# Altium schematic sheet Controller Board - Connectors.SchDoc: Controller Board - Connectors
size B; Organization: Midnight Sun Solar Rayce Car Team; Address1: University of Waterloo; Address2: 200 University Ave W; Address3: Waterloo, ON, Canada; Address4: N2L 3E9; DocumentNumber: 1; SheetNumber: 1; SheetTotal: 3; Website: www.uwmidsun.com; ProjectName: ProjectName
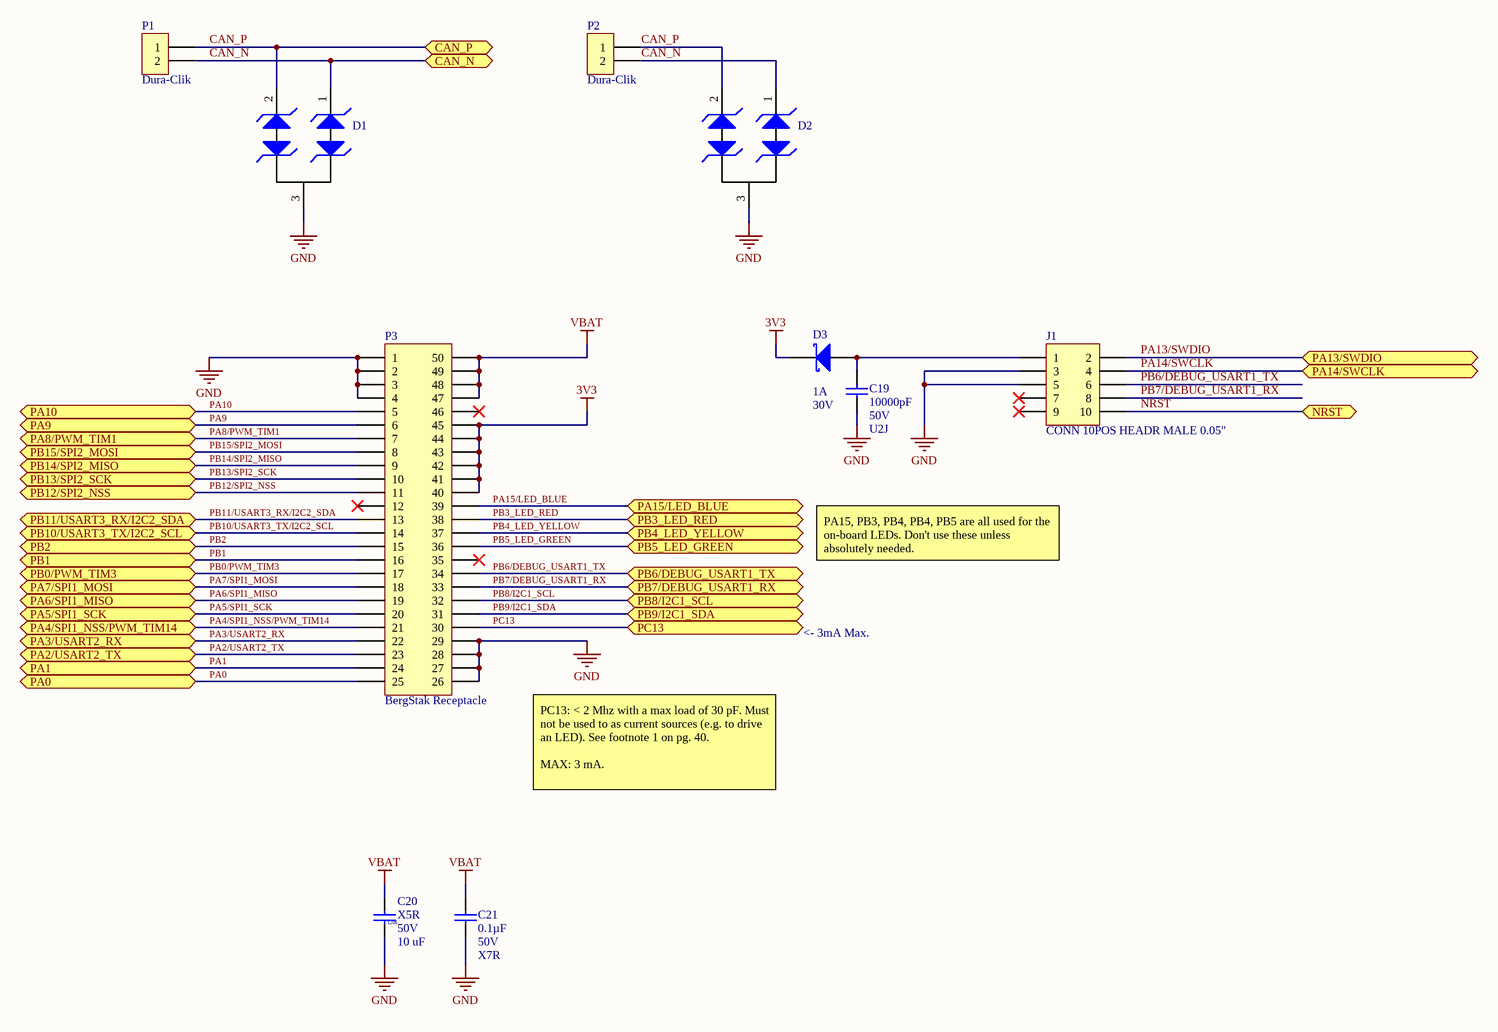
[diagram p0: Controller Board - Connectors.SchDoc]

## Parts
C19  Capacitance: 10000pF  Voltage: 50V  Temperature Coefficient: U2J  [CAP, 0603]  (hidden comment: CAP CER 10nF 50V 5% X7R 0603)
C20  Rating: X5R  Voltage Rating: 50V  Capacitance: 10 uF  [CAP, 1206]  (hidden comment: CAP CER 10uF 50V 20% X5R 1206)
C21  Capacitance: 0.1µF  Voltage: 50V  Temperature Coefficient: X7R  [CAP, 0603]  (hidden comment: CAP CER 0.1UF 50V 10% X7R 0603)
D1  DIODE TVS 24VWM 70VC SOT23  [MOSFET P-CH 30V 3.8A SOT-23]  (value not drawn)
D2  DIODE TVS 24VWM 70VC SOT23  [MOSFET P-CH 30V 3.8A SOT-23]  (value not drawn)
D3  Current - Average Rectified (Io): 1A  Voltage - DC Reverse (Vr) (Max): 30V  [DIODE SCHOTTKY 30V 1A POWERDI123]  (hidden comment: DIODE SCHOTTKY 30V 1A POWERDI123)
J1  CONN 10POS HEADR MALE 0.05"  [CONN, 10POS 0.05" Debug Header]
P1  Dura-Clik  [CONN, 2POS Dura-Click Vertical]
P2  Dura-Clik  [CONN, 2POS Dura-Click Vertical]
P3  Series: BergStak Receptacle  [CONN, Bergstak 50 Pos Receptacle]  (hidden comment: CONN 50POS Bergstak Receptacle 0.02")

## Ports
CAN_N (bidir), CAN_P (bidir), NRST (bidir), PA0 (bidir), PA1 (bidir), PA2/USART2_TX (bidir), PA3/USART2_RX (bidir), PA4/SPI1_NSS/PWM_TIM14 (bidir), PA5/SPI1_SCK (bidir), PA6/SPI1_MISO (bidir), PA7/SPI1_MOSI (bidir), PA8/PWM_TIM1 (bidir), PA9 (bidir), PA10 (bidir), PA13/SWDIO (bidir), PA14/SWCLK (bidir), PA15/LED_BLUE (bidir), PB0/PWM_TIM3 (bidir), PB1 (bidir), PB2 (bidir), PB3_LED_RED (bidir), PB4_LED_YELLOW (bidir), PB5_LED_GREEN (bidir), PB6/DEBUG_USART1_TX (bidir), PB7/DEBUG_USART1_RX (bidir), PB8/I2C1_SCL (bidir), PB9/I2C1_SDA (bidir), PB10/USART3_TX/I2C2_SCL (bidir), PB11/USART3_RX/I2C2_SDA (bidir), PB12/SPI2_NSS (bidir), PB13/SPI2_SCK (bidir), PB14/SPI2_MISO (bidir), PB15/SPI2_MOSI (bidir), PC13 (bidir)

## Nets
3V3: D3.2(K) P3.40 P3.41 P3.42 P3.43 P3.44 P3.45
GND: C19.2 C20.2 C21.2 D1.3(Common_Cathode) D2.3(Common_Cathode) J1.3 J1.5 P3.1 P3.2 P3.3 P3.4 P3.26 P3.27 P3.28 P3.29
VBAT: C20.1 C21.1 P3.47 P3.48 P3.49 P3.50
CAN_N: D1.1(Cathode1) D2.1(Cathode1) P1.2 P2.2 ; port CAN_N
CAN_P: D1.2(Cathode2) D2.2(Cathode2) P1.1 P2.1 ; port CAN_P
NRST: J1.10 ; port NRST
PA0: P3.25 ; port PA0
PA1: P3.24 ; port PA1
PA2/USART2_TX: P3.23 ; port PA2/USART2_TX
PA3/USART2_RX: P3.22 ; port PA3/USART2_RX
PA4/SPI1_NSS/PWM_TIM14: P3.21 ; port PA4/SPI1_NSS/PWM_TIM14
PA5/SPI1_SCK: P3.20 ; port PA5/SPI1_SCK
PA6/SPI1_MISO: P3.19 ; port PA6/SPI1_MISO
PA7/SPI1_MOSI: P3.18 ; port PA7/SPI1_MOSI
PA8/PWM_TIM1: P3.7 ; port PA8/PWM_TIM1
PA9: P3.6 ; port PA9
PA10: P3.5 ; port PA10
PA13/SWDIO: J1.2 ; port PA13/SWDIO
PA14/SWCLK: J1.4 ; port PA14/SWCLK
PA15/LED_BLUE: P3.39 ; port PA15/LED_BLUE
PB0/PWM_TIM3: P3.17 ; port PB0/PWM_TIM3
PB1: P3.16 ; port PB1
PB2: P3.15 ; port PB2
PB3_LED_RED: P3.38 ; port PB3_LED_RED
PB4_LED_YELLOW: P3.37 ; port PB4_LED_YELLOW
PB5_LED_GREEN: P3.36 ; port PB5_LED_GREEN
PB6/DEBUG_USART1_TX: J1.6 P3.34 ; port PB6/DEBUG_USART1_TX
PB7/DEBUG_USART1_RX: J1.8 P3.33 ; port PB7/DEBUG_USART1_RX
PB8/I2C1_SCL: P3.32 ; port PB8/I2C1_SCL
PB9/I2C1_SDA: P3.31 ; port PB9/I2C1_SDA
PB10/USART3_TX/I2C2_SCL: P3.14 ; port PB10/USART3_TX/I2C2_SCL
PB11/USART3_RX/I2C2_SDA: P3.13 ; port PB11/USART3_RX/I2C2_SDA
PB12/SPI2_NSS: P3.11 ; port PB12/SPI2_NSS
PB13/SPI2_SCK: P3.10 ; port PB13/SPI2_SCK
PB14/SPI2_MISO: P3.9 ; port PB14/SPI2_MISO
PB15/SPI2_MOSI: P3.8 ; port PB15/SPI2_MOSI
PC13: P3.30 ; port PC13
NetC19_1: C19.1 D3.1(A) J1.1

Not connected (* = marked no-connect by the designer): J1 7* 9*; P3 12* 35* 46*

## Notes on the sheet
- PA15, PB3, PB4, PB4, PB5 are all used for the on-board LEDs. Don't use these unless absolutely needed.
- <- 3mA Max.
- PC13: < 2 Mhz with a max load of 30 pF. Must not be used to as current sources (e.g. to drive an LED). See footnote 1 on pg. 40.
  MAX: 3 mA.
- PROJECT
- DOCUMENT
- DRAWN BY
- LAST MODIFIED
- PART NUMBER
- REVISION
- SHEET
- VARIANT
- OF
- Engineering 5 - 1002
  University of Waterloo
  (519) 888-4567 x32978
  hardware@uwmidsun.com

## Library data of the parts
C19 = CAP CER 10nF 50V 5% X7R 0603: 10000pF ±5% 50V Ceramic Capacitor U2J 0603 (1608 Metric); Manufacturer 1: KEMET; Manufacturer Part Number 1: C0603C103J5JAC7867; Supplier 1: Digi-Key; Supplier Part Number 1: 399-13384-1-ND; Packaging: Cut Tape (CT); Part Status: Active; Operating Temperature: -55°C ~ 125°C; Ratings: -; Mounting Type: Surface Mount, MLCC; Package / Case: 0603 (1608 Metric); Size / Dimension: 0.063" L x 0.032" W (1.60mm x 0.80mm); Height - Seated (Max): -; Thickness (Max): 0.034" (0.87mm); Lead Spacing: -; Lead Style: -; ComponentLink1URL: http://www.kemet.com/docfinder?Partnumber=C0603C103J5JAC7867; ComponentLink1Description: http://www.kemet.com/docfinder?Partnumber=C0603C103J5JAC7867; Tolerance: ±5%; Failure Rate: -
C20 = CAP CER 10uF 50V 20% X5R 1206: 10µF ±20% 50V Ceramic Capacitor X5R 1206 (3216 Metric) /; Manufacturer: Murata; Manufacturer Part Number: GRT31CR61H106ME01L; Supplier 1: Digi-Key; Supplier Part Number 1: 490-12457-1-ND; RoHS: Yes; Stock 1: 449467; Pricing 1: 1 = 0.57000, 10 = 0.39800, 100 = 0.23910, 500 = 0.17930, 1000 = 0.15141 (USD); Mount: Surface Mount; Case/Package: 1206; Case Code (Metric): 3216; Case Code (Imperial): 1206; Min Operating Temperature: -55°C; Max Operating Temperature: 85°C; Packaging: Tape and Reel; Tolerance: 20%; Length: 0.126inch; Width: 0.063inch; Thickness: 0.071inch; Ratings: AEC-Q200
C21 = CAP CER 0.1UF 50V 10% X7R 0603: 0.10µF ±10% 50V Ceramic Capacitor X7R 0603 (1608 Metric); Manufacturer 1: AVX Corporation; Manufacturer Part Number 1: 06035C104KAT2A; Supplier 1: Digi-Key; Supplier Part Number 1: 478-5052-1-ND; Packaging: Cut Tape (CT); Part Status: Active; Operating Temperature: -55°C ~ 125°C; Ratings: -; Mounting Type: Surface Mount, MLCC; Package / Case: 0603 (1608 Metric); Size / Dimension: 0.063" L x 0.032" W (1.60mm x 0.81mm); Height - Seated (Max): -; Thickness (Max): 0.035" (0.90mm); Lead Spacing: -; Lead Style: -; ComponentLink1URL: http://datasheets.avx.com/X7RDielectric.pdf; ComponentLink1Description: http://datasheets.avx.com/X7RDielectric.pdf; Tolerance: ±10%
D1 D2 = DIODE TVS 24VWM 70VC SOT23: TVS DIODE 24VWM 70VC SOT23; Manufacturer 1: Nexperia USA Inc.; Manufacturer Part Number 1: PESD1CAN,215; Type: Zener; Voltage - Breakdown (Min): 25.4V; Voltage - Clamping (Max) @ Ipp: 70V; Current - Peak Pulse (10/1000µs): 3A (8/20µs); Power - Peak Pulse: 200W; Power Line Protection: No; Capacitance @ Frequency: 11pF @ 1MHz; Supplier 1: Digi-Key; Supplier Part Number 1: 1727-3817-1-ND; Packaging: Cut Tape (CT); Part Status: Active; Operating Temperature: -65°C ~ 150°C (TA); Mounting Type: Surface Mount; Package / Case: TO-236-3, SC-59, SOT-23-3; Supplier Device Package: SOT-23 (TO-236AB); ComponentLink1URL: http://assets.nexperia.com/documents/data-sheet/PESD1CAN.pdf; ComponentLink1Description: http://assets.nexperia.com/documents/data-sheet/PESD1CAN.pdf
D3 = DIODE SCHOTTKY 30V 1A POWERDI123: Diode Schottky 30V 1A Surface Mount PowerDI™ 123; Manufacturer: Diodes Incorporated; Manufacturer Part Number: DFLS130L-7; Speed: Fast Recovery =< 500ns, > 200mA (Io); Current - Reverse Leakage @ Vr: 1mA @ 30V; Capacitance @ Vr, F: 76pF @ 10V, 1MHz; Voltage - Forward (Vf) (Max) @ If: 310mV @ 1A; Supplier 1: Digi-Key; RoHS: RoHS Compliant; Category: Discrete Semiconductor Products; Stock 1: 68200; Packaging: Cut Tape (CT); Part Status: Active; Diode Type: Schottky; Mounting Type: Surface Mount; Package / Case: POWERDI®123; Supplier Device Package: PowerDI™ 123; Operating Temperature - Junction: -40°C ~ 125°C; ComponentLink1URL: https://www.diodes.com/assets/Datasheets/ds30492.pdf; ComponentLink1Description: https://www.diodes.com/assets/Datasheets/ds30492.pdf; Supplier Part Number 1: DFLS130LDICT-ND; Pricing 1: 1=0.7, 10=0.599, 100=0.447, 500=0.35126, 1000=0.27142 (CAD)
J1 = CONN 10POS HEADR MALE 0.05": 10 Positions Header Connector 0.050" (1.27mm) Surface Mount Gold; Manufacturer 1: Amphenol FCI; Manufacturer Part Number 1: 20021121-00010C4LF; Style: Board to Board; Shrouding: Unshrouded; Number of Positions: 10; Number of Positions Loaded: All; Contact Length - Mating: 0.120" (3.05mm); Material Flammability Rating: UL94 V-0; Supplier 1: Digi-Key; Supplier Part Number 1: 609-3695-1-ND; Packaging: Cut Tape (CT); Part Status: Active; Connector Type: Header; Contact Type: Male Pin; Number of Rows: 2; Row Spacing - Mating: 0.050" (1.27mm); Mounting Type: Surface Mount; Termination: Solder; Fastening Type: -; Contact Length - Post: -; Overall Contact Length: -; Insulation Height: -; Contact Shape: Square; Contact Finish - Mating: Gold; Contact Finish Thickness - Mating: 10µin (0.25µm); Contact Finish - Post: Tin; Contact Material: Copper Alloy; Insulation Material: Thermoplastic; Operating Temperature: -; Ingress Protection: -; Insulation Color: Black; Current Rating: -; Mated Stacking Heights: -; Contact Finish Thickness - Post: 50µin (1.27µm); ComponentLink1URL: http://portal.fciconnect.com/Comergent//fci/drawing/20021121.pdf; ComponentLink1Description: http://portal.fciconnect.com/Comergent//fci/drawing/20021121.pdf; Voltage: -; Pitch - Mating: 0.050" (1.27mm)
P1 P2 = CONN 2POS DURA-CLIK 0.079" VERT: 2 Positions Header, Shrouded Connector 0.079" (2.00mm) Surface Mount, Vertical Tin; Manufacturer: Molex, LLC; Manufacturer Part Number: 5600200220; Style: Board to Cable/Wire; Shrouding: Shrouded - 4 Wall; Number of Positions: 2; Number of Positions Loaded: All; Mated Stacking Heights: 9.3mm; Supplier 1: Digi-Key; RoHS: RoHS Compliant; Category: Connectors, Interconnects; Stock 1: 11912; Pricing 1: 1=1.16, 10=1.012, 25=0.952, 50=0.9122, 100=0.8727, 250=0.79336 (CAD); Packaging: Cut Tape (CT); Part Status: Active; Connector Type: Header; Contact Type: Male Pin; Pitch - Mating: 0.079" (2.00mm); Number of Rows: 1; Row Spacing - Mating: -; Mounting Type: Surface Mount; Termination: Solder; Fastening Type: Latch Lock; Contact Length - Mating: -; Contact Length - Post: -; Overall Contact Length: -; Insulation Height: 0.315" (8.00mm); Contact Shape: Square; Contact Finish - Mating: Tin; Contact Finish Thickness - Mating: -; Contact Finish - Post: Tin; Contact Material: Copper Alloy; Insulation Material: Polyamide (PA), Nylon; Features: Solder Retention; Operating Temperature: -; Ingress Protection: -; Material Flammability Rating: -; Insulation Color: Natural; Current Rating: -; Voltage Rating: -; Contact Finish Thickness - Post: -; Applications: Automotive, Industrial; ComponentLink1URL: http://www.molex.com/pdm_docs/sd/5600200220_sd.pdf; ComponentLink1Description: http://www.molex.com/pdm_docs/sd/5600200220_sd.pdf; Supplier Part Number 1: WM10862CT-ND
P3 = CONN 50POS Bergstak Receptacle 0.02": 50 Position Connector Receptacle, Center Strip Contacts Surface Mount Gold; Manufacturer 1: Amphenol FCI; Manufacturer Part Number 1: 10132798-052100LF; Number of Positions: 50; Mated Stacking Heights: 5mm, 5.5mm, 6mm; Pitch: 0.020" (0.50mm); Supplier 1: Digi-Key; Supplier Part Number 1: 609-5227-1-ND; Packaging: Cut Tape (CT); Part Status: Active; Connector Type: Receptacle, Center Strip Contacts; Number of Rows: 2; Mounting Type: Surface Mount; Contact Finish: Gold; Contact Finish Thickness: 1µin (0.025µm); Height Above Board: 0.106" (2.70mm); ComponentLink1URL: http://portal.fciconnect.com/Comergent//fci/drawing/10132798.pdf; ComponentLink1Description: http://portal.fciconnect.com/Comergent//fci/drawing/10132798.pdf